# EAGLE design cherryKeyShield (EAGLE 8.2.2)
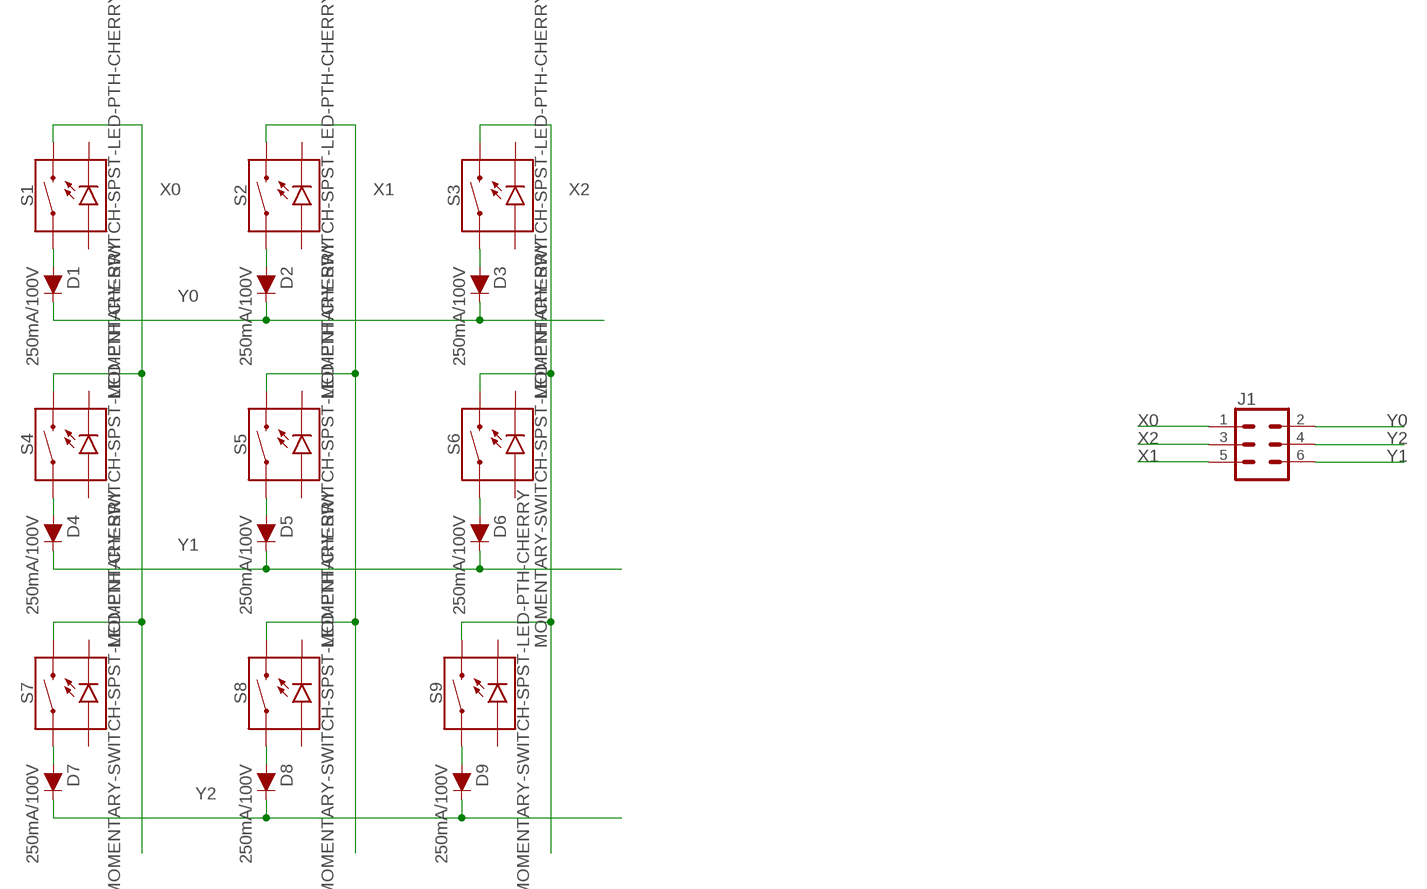
[diagram p0: schematic, sheet 1]

## Parts
D1  250mA/100V  DIODE-BAS16J  [SOD-323]
D2  250mA/100V  DIODE-BAS16J  [SOD-323]
D3  250mA/100V  DIODE-BAS16J  [SOD-323]
D4  250mA/100V  DIODE-BAS16J  [SOD-323]
D5  250mA/100V  DIODE-BAS16J  [SOD-323]
D6  250mA/100V  DIODE-BAS16J  [SOD-323]
D7  250mA/100V  DIODE-BAS16J  [SOD-323]
D8  250mA/100V  DIODE-BAS16J  [SOD-323]
D9  250mA/100V  DIODE-BAS16J  [SOD-323]
J1  CONN_03X22X3_SILK_MALE_PTH  [2X3]
S1  MOMENTARY-SWITCH-SPST-LED-PTH-CHERRY  [CHERRY-MX-LED]
S2  MOMENTARY-SWITCH-SPST-LED-PTH-CHERRY  [CHERRY-MX-LED]
S3  MOMENTARY-SWITCH-SPST-LED-PTH-CHERRY  [CHERRY-MX-LED]
S4  MOMENTARY-SWITCH-SPST-LED-PTH-CHERRY  [CHERRY-MX-LED]
S5  MOMENTARY-SWITCH-SPST-LED-PTH-CHERRY  [CHERRY-MX-LED]
S6  MOMENTARY-SWITCH-SPST-LED-PTH-CHERRY  [CHERRY-MX-LED]
S7  MOMENTARY-SWITCH-SPST-LED-PTH-CHERRY  [CHERRY-MX-LED]
S8  MOMENTARY-SWITCH-SPST-LED-PTH-CHERRY  [CHERRY-MX-LED]
S9  MOMENTARY-SWITCH-SPST-LED-PTH-CHERRY  [CHERRY-MX-LED]

## Nets
N$1: D5.A S5.S1
N$2: D6.A S6.S1
N$7: D1.A S1.S1
N$10: D2.A S2.S1
N$11: D3.A S3.S1
N$12: D4.A S4.S1
N$13: D8.A S8.S1
N$14: D7.A S7.S1
N$17: D9.A S9.S1
X0: J1.1 S1.S2 S4.S2 S7.S2
X1: J1.5 S2.S2 S5.S2 S8.S2
X2: J1.3 S3.S2 S6.S2 S9.S2
Y0: D1.C D2.C D3.C J1.2
Y1: D4.C D5.C D6.C J1.6
Y2: D7.C D8.C D9.C J1.4
Unconnected: S1.A S1.K(C) S2.A S2.K(C) S3.A S3.K(C) S4.A S4.K(C) S5.A S5.K(C) S6.A S6.K(C) S7.A S7.K(C) S8.A S8.K(C) S9.A S9.K(C)

## Library data of the parts
D1-D9 = SparkFun-DiscreteSemi:DIODE: Diode These are standard reverse protection diodes and small signal diodes. SparkFun Products: SparkFun SparkPunk Sound Kit <https://www.sparkfun.com/products/11177> SparkFun ESP8266 Thing <https://www.sparkfun.com/products/13231>; PROD_ID: DIO-09646
J1 = SparkFun-Connectors:CONN_03X2: Multi connection point. Often used as Generic Header-pin footprint for 0.1 inch spaced/style header connections You can populate with any combo of single row headers, but if you'd like an exact match, check these: Header - 2x3 (Male, 0.1") <https://www.sparkfun.com/products/12807> (PRT-12807) Header - 2x3 (Female, 0.1") <https://www.sparkfun.com/products/13010> (PRT-13010) 2x3 Pin Shrouded Header <https://www.sparkfun.com/products/10877> (PRT-10877) On any of the 0.1 inch spaced packages, you can populate with these: Break Away Headers - Straight <https://www.sparkfun.com/products/116> (PRT-00116) Break Away Male Headers - Right Angle <https://www.sparkfun.com/products/553> (PRT-00553) Female Headers <https://www.sparkfun.com/products/115> (PRT-00115) Break Away Headers - Machine Pin <https://www.sparkfun.com/products/117> (PRT-00117) Break Away Female Headers - Swiss Machine Pin <https://www.sparkfun.com/products/743> (PRT-00743) Special note: the shrouded connector mates well with our 3x2 ribbon cables: Ribbon Crimp Connector - 6-pin (2x3, Female) <https://www.sparkfun.com/products/10651> (PRT-10651) Ribbon Cable - 6 wire (15ft) <https://www.sparkfun.com/products/10646> (PRT-10646); PROD_ID: CONN-09701
S1-S9 = SparkFun-Switches:MOMENTARY-SWITCH-SPST-LED: Momentary Switch (Pushbutton) - SPST - w/ LED Normally-open (NO) SPST momentary switches (buttons, pushbuttons), with a built-in LED. Variants PTH-CHERRY - Cherry MX Switch Cherry MX Keyswitches are top-of-the-line mechanical keyboard switches. They’re satisfyingly “clicky”, reliable up to tens-of-millions of key presses, and a standard in gaming and programming keyboards across the globe. This ‘blue’ version Cherry MX Switch is favored by most due to its secondary internal actuator making it less likely to “double-tap.” If you are looking for a noticeably audible and high-quality key switch, this is the perfect option for you! Cherry MX Switch <https://www.sparkfun.com/products/13834> (COM-13834) Cherry MX Switch Breakout <https://www.sparkfun.com/products/13773> (BOB-13773) PTH-12MM and PTH-12MM-KIT - 12mm Illuminated LED KIT variant is for soldering kits. There is no tStop (covering up the top side of the pads with mask). This helps the beginner see which side they should be soldering too. LED Tactile Button Breakout <https://www.sparkfun.com/products/10467> (BOB-10467) LED Tactile Button - Red <https://www.sparkfun.com/products/10442> (COM-10442) LED Tactile Button - Blue <https://www.sparkfun.com/products/10443> (COM-10443) LED Tactile Button - Green <https://www.sparkfun.com/products/10440> (COM-10440) LED Tactile Button - Orange <https://www.sparkfun.com/products/10441> (COM-10441) LED Tactile Button - White <https://www.sparkfun.com/products/10439> (COM-10439); SF_ID: COM-13834

## Board
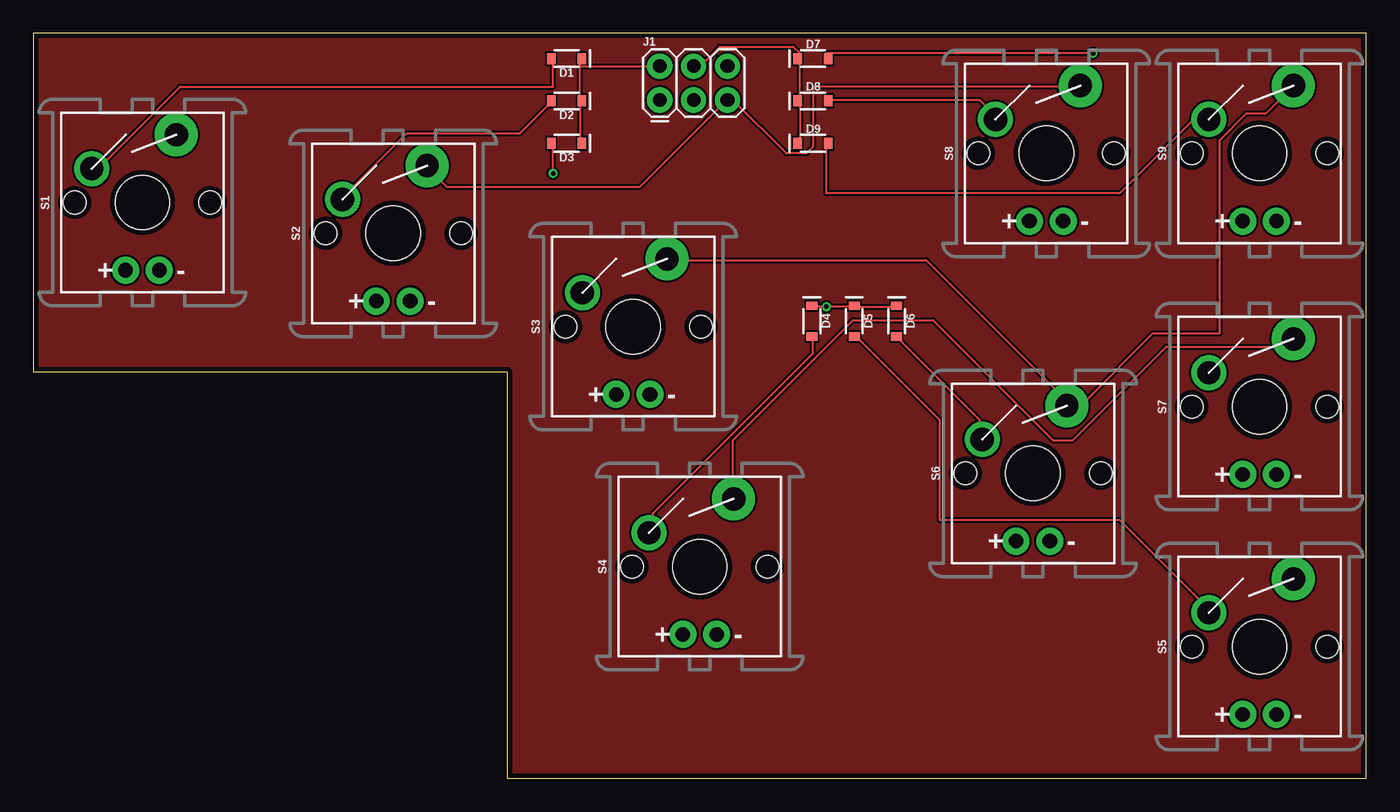
[diagram p1: board, top side]
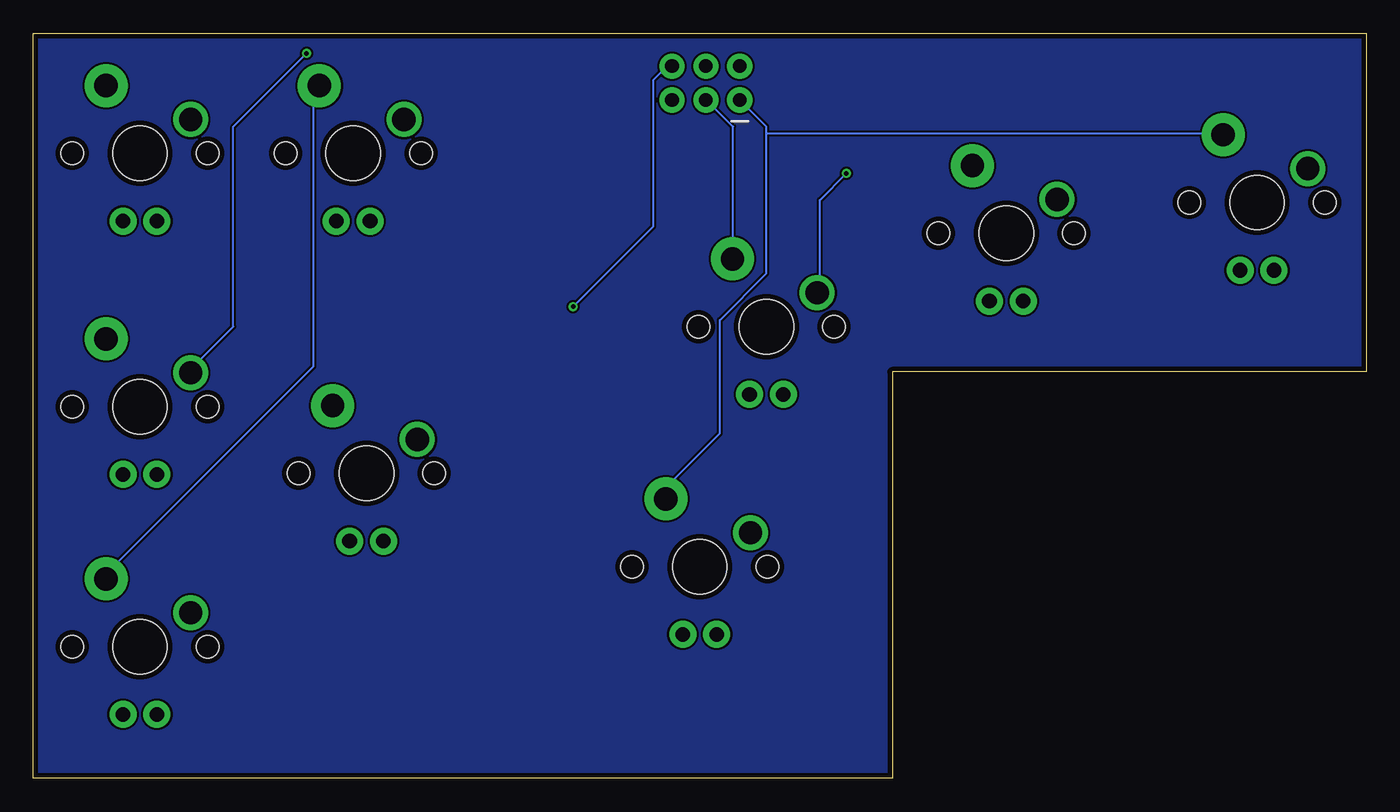
[diagram p2: board, bottom side, seen from below]

Size 100 x 55.87 mm. Coordinates in mm from the lower left corner, seen from the top.
Outline: 0,30.48 35.56,30.48 35.56,0 100,0 100,55.87 0,55.87 0,30.48
Copper layers (1*16): Top 0.0356mm / dielectric 1.5011mm / Bottom 0.0356mm
Design rules "LaenPCBOrder": minimum track width 6mil, minimum drill 13mil, track to track 6mil, track to pad 6mil, pad to pad 6mil, via to via 6mil, smd to smd 6mil, copper to edge 15mil, drill to drill 6mil, minimum pad ring 7mil, minimum via ring 7mil, stop-mask expansion 3mil, vias tented up to drill 0mil, thermal gap 10mil

### Footprints (pad centres in the part's own frame; a part is rotated, then mirrored left to right if it is on the bottom)
SOD-323 = smd 0.63 x 0.83: A 1.15,0; C -1.15,0
2X3 = drill 1.016 pad 1.88: 1 0,0; 2 0,2.54; 3 2.54,0; 4 2.54,2.54; 5 5.08,0; 6 5.08,2.54
CHERRY-MX-LED = drill 1.092 pad 2.032: A -1.27,-5.08; K 1.27,-5.08 | drill 1.753 pad 2.54: S1 -3.81,2.54 | drill 1.753 pad 3.226: S2 2.54,5.08 | hole 4.089: 0,0 | hole 1.707: -5.08,0; 5.08,0

### Placement (x,y rotation side)
D1  40,53.98 180 top
D2  40,50.8 180 top
D3  40,47.62 180 top
D4  58.42,34.29 270 top
D5  61.59,34.29 270 top
D6  64.77,34.29 270 top
D7  58.5,53.98 0 top
D8  58.5,50.8 0 top
D9  58.5,47.62 0 top
J1  47,50.87 0 top
S1  8.19,43.18 0 top
S2  27,40.87 0 top
S3  45,33.87 0 top
S4  50,15.87 0 top
S5  92,9.87 0 top
S6  75,22.87 0 top
S7  92,27.87 0 top
S8  76,46.87 0 top
S9  92,46.87 0 top

### Tracks (layer width: path | path; a pad name or v marks a point on that pad's centre or on a via)
N$1
  Top 0.152: D5.A 62,32.87 68,26.87 68,19.37 81.5,19.37 88,12.87 S5.S1
N$2
  Top 0.152: D6.A 65,32.87 71,26.87 71,25.87 S6.S1
N$7
  Top 0.152: D1.A 39,53.87 39,51.87 11,51.87 5,45.87 4.5,45.87 S1.S1
N$10
  Top 0.152: D2.A 39,50.87 36.5,48.37 28,48.37 23.5,43.87 S2.S1
N$11  (via drill 0.33)
  Top 0.152: v39,45.37 39,47.37 D3.A
  Bottom 0.152: v39,45.37 41,43.37 41,36.87 S3.S1
N$12
  Top 0.152: D4.A 58.5,32.87 58.5,31.87 46.5,19.87 46.5,18.87 S4.S1
N$13
  Top 0.152: D8.A 59.5,50.87 71,50.87 72,49.87 S8.S1
N$14  (via drill 0.33)
  Top 0.152: v79.5,54.37 59.5,54.37 D7.A
  Bottom 0.152: v79.5,54.37 85,48.87 85,33.87 88,30.87 S7.S1
N$17
  Top 0.152: D9.A 59.5,47.37 59.5,43.87 81.5,43.87 87,49.37 88,49.37 S9.S1
S$1
  pour Top: 0,55.88 100.33,55.88 100.33,0 35.56,0 35.56,30.48 0,30.48
S$2
  pour Bottom: 0,55.88 100.33,55.88 100.33,0 35.56,0 35.56,30.48 0,30.48
X0
  Top 0.152: S7.S2 94.5,32.87 94,32.37 85,32.37 78,25.37 76.5,25.37 67.5,34.37 61.5,34.37 52.5,25.37 52.5,21.37 S4.S2
  Bottom 0.152: J1.1 45,48.87 45,48.37 | 45,48.37 45,37.87 48.5,34.37 48.5,25.87 52.5,21.87 52.5,21.37 S4.S2 | 45,48.37 11,48.37 S1.S2
X1
  Top 0.152: S2.S2 29.5,45.87 31,44.37 45.5,44.37 52,50.87 J1.5 52.5,50.87 56.5,46.87 58,46.87 58.5,47.37 58.5,51.87 78.5,51.87 S8.S2
  Bottom 0.152: S5.S2 94.5,15.37 79,30.87 79,51.87 S8.S2
X2
  Top 0.152: S3.S2 48,38.87 67,38.87 77.5,28.37 S6.S2 78,28.37 79,28.37 84,33.37 89,33.37 89,47.87 91,49.87 92.5,49.87 94.5,51.87 S9.S2
  Bottom 0.152: J1.3 49.5,50.87 47.5,48.87 47.5,39.37 S3.S2
Y0
  Top 0.152: 41,50.87 41,47.87 D3.C | 41,50.87 41,53.37 | 41,53.37 41,53.87 D1.C | 41,50.87 D2.C | 41,53.37 47,53.37 J1.2
Y1  (via drill 0.33)
  Top 0.152: D4.C 58.5,35.37 v59.5,35.37 61.5,35.37 D5.C 62,35.37 64.5,35.37 D6.C
  Bottom 0.152: v59.5,35.37 53.5,41.37 53.5,52.37 52.5,53.37 J1.6
Y2
  Top 0.152: 57.5,50.87 57.5,47.87 D9.C | 57.5,50.87 57.5,53.87 D7.C 57.5,54.37 57,54.87 51.5,54.87 50.5,53.87 50,53.87 J1.4 | 57.5,50.87 D8.C